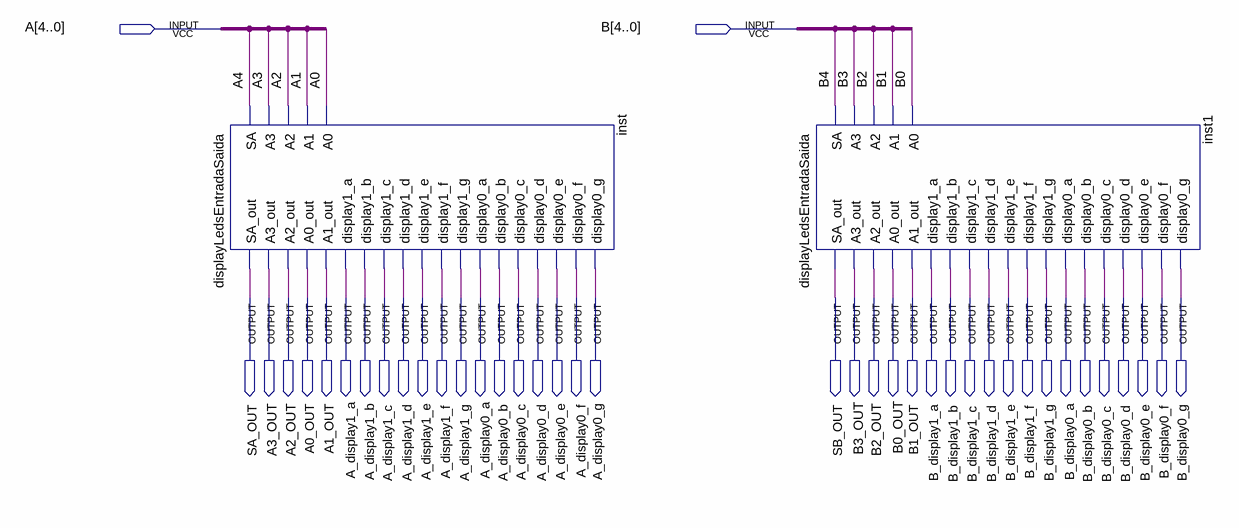
[diagram p0: schematic sheet]
// Quartus schematic inputDisplay.bdf as structural Verilog: 2 symbols, 40 pins
module inputDisplay (
  input  [4:0] A,
  input  [4:0] B,
  output SA_OUT,
  output A3_OUT,
  output A2_OUT,
  output A0_OUT,
  output A1_OUT,
  output A_display1_a,
  output A_display1_b,
  output A_display1_c,
  output A_display1_d,
  output A_display1_e,
  output A_display1_f,
  output A_display1_g,
  output A_display0_a,
  output A_display0_b,
  output A_display0_c,
  output A_display0_d,
  output A_display0_e,
  output A_display0_f,
  output A_display0_g,
  output SB_OUT,
  output B3_OUT,
  output B2_OUT,
  output B0_OUT,
  output B1_OUT,
  output B_display1_a,
  output B_display1_b,
  output B_display1_c,
  output B_display1_d,
  output B_display1_e,
  output B_display1_f,
  output B_display1_g,
  output B_display0_a,
  output B_display0_b,
  output B_display0_c,
  output B_display0_d,
  output B_display0_e,
  output B_display0_f,
  output B_display0_g
);

  displayLedsEntradaSaida inst (
    .SA(A[4]), .A3(A[3]), .A2(A[2]), .A1(A[1]), .A0(A[0]), .SA_out(SA_OUT), .A3_out(A3_OUT), .A2_out(A2_OUT),
    .A0_out(A0_OUT), .A1_out(A1_OUT), .display1_a(A_display1_a), .display1_b(A_display1_b),
    .display1_c(A_display1_c), .display1_d(A_display1_d), .display1_e(A_display1_e),
    .display1_f(A_display1_f), .display1_g(A_display1_g), .display0_a(A_display0_a),
    .display0_b(A_display0_b), .display0_c(A_display0_c), .display0_d(A_display0_d),
    .display0_e(A_display0_e), .display0_f(A_display0_f), .display0_g(A_display0_g));
  displayLedsEntradaSaida inst1 (
    .SA(B[4]), .A3(B[3]), .A2(B[2]), .A1(B[1]), .A0(B[0]), .SA_out(SB_OUT), .A3_out(B3_OUT), .A2_out(B2_OUT),
    .A0_out(B0_OUT), .A1_out(B1_OUT), .display1_a(B_display1_a), .display1_b(B_display1_b),
    .display1_c(B_display1_c), .display1_d(B_display1_d), .display1_e(B_display1_e),
    .display1_f(B_display1_f), .display1_g(B_display1_g), .display0_a(B_display0_a),
    .display0_b(B_display0_b), .display0_c(B_display0_c), .display0_d(B_display0_d),
    .display0_e(B_display0_e), .display0_f(B_display0_f), .display0_g(B_display0_g));
endmodule
